# Altium schematic sheet Sensors.SchDoc
size A; SheetNumber: 3; SheetTotal: 4
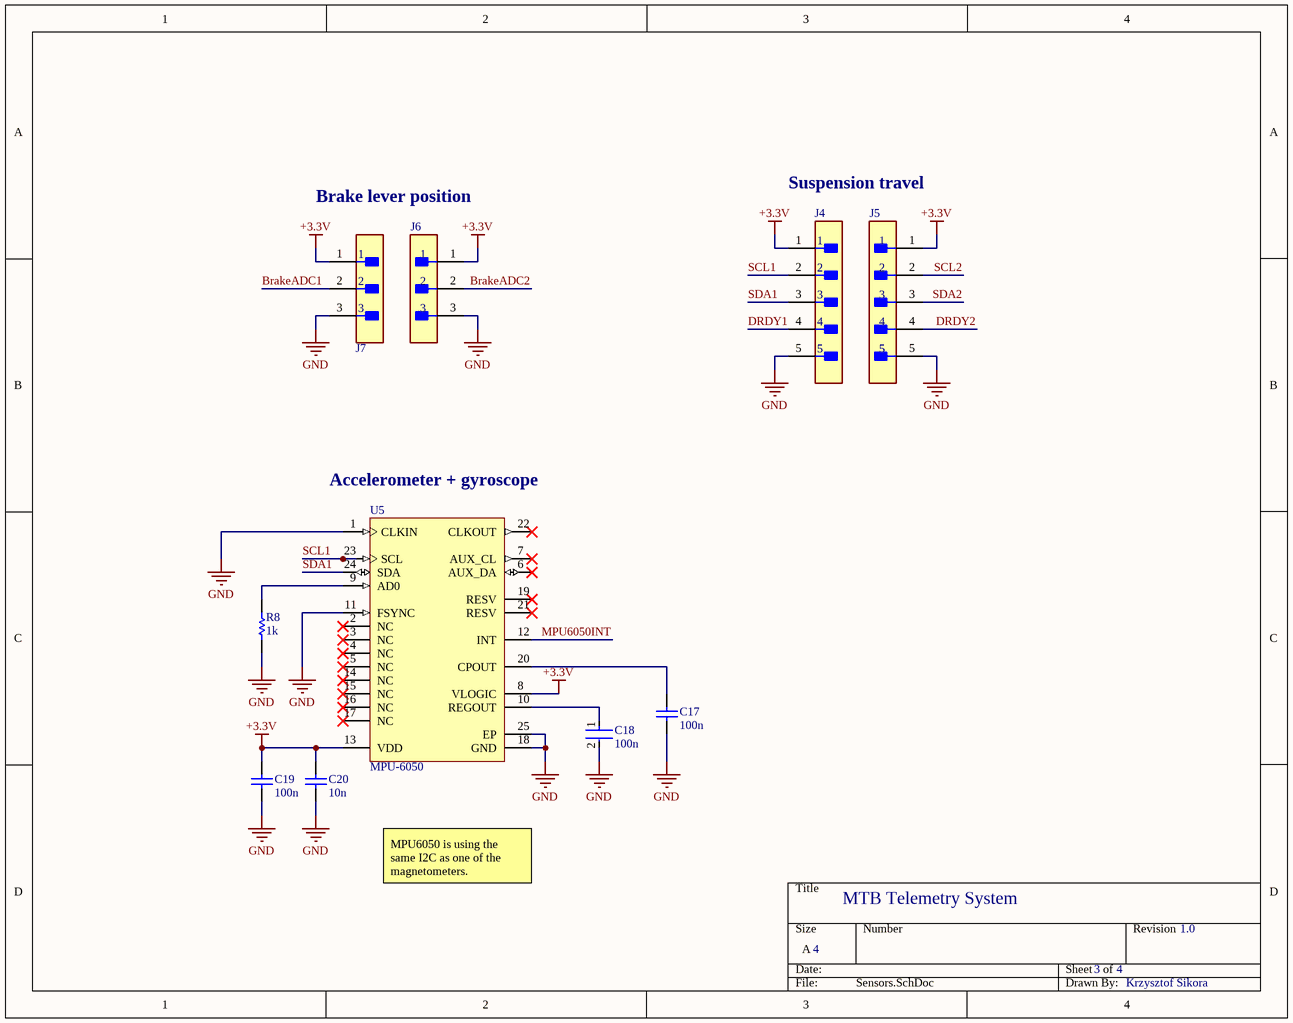
[diagram p0: Sensors.SchDoc]

## Parts
C17  100n  [CAPC2013X88X50LL20T25]
C18  100n  [FP-C0603C-CF-MFG]
C19  100n  [CAPC2013X88X50LL20T25]
C20  10n  [CAPC2013X88X50LL20T25]
J4  B5B-XH-AM(LF)(SN)  [FP-B5B-XH-AM_LF_SN-MFG]  (value not drawn)
J5  B5B-XH-AM(LF)(SN)  [FP-B5B-XH-AM_LF_SN-MFG]  (value not drawn)
J6  B3B-XH-A(LF)(SN)  [FP-B3B-XH-A_LF_SN-MFG]  (value not drawn)
J7  B3B-XH-A(LF)(SN)  [FP-B3B-XH-A_LF_SN-MFG]  (value not drawn)
R8  1k  [RESC2013X60X35ML10T20]
U5  MPU-6050  [IS-QFN-24_V]

## Nets
+3.3V: C19.2 C20.2 J4.1 J5.1 J6.1 J7.1 U5.8(VLOGIC) U5.13(VDD)
GND: C17.1 C18.2 C19.1 C20.1 J4.5 J5.5 J6.3 J7.3 R8.1 U5.1(CLKIN) U5.11(FSYNC) U5.18(GND) U5.25(EP)
BrakeADC1: J7.2
BrakeADC2: J6.2
DRDY1: J4.4
DRDY2: J5.4
MPU6050INT: U5.12(INT)
SCL1: J4.2 U5.23(SCL)
SCL2: J5.2
SDA1: J4.3 U5.24(SDA)
SDA2: J5.3
NetC17_2: C17.2 U5.20(CPOUT)
NetC18_1: C18.1 U5.10(REGOUT)
NetR8_2: R8.2 U5.9(AD0)

Not connected (* = marked no-connect by the designer): U5 2(NC)* 3(NC)* 4(NC)* 5(NC)* 6(AUX_DA)* 7(AUX_CL)* 14(NC)* 15(NC)* 16(NC)* 17(NC)* 19(RESV)* 21(RESV)* 22(CLKOUT)*

## Notes on the sheet
- Brake lever position
- Suspension travel
- (near U5) Accelerometer + gyroscope
- MPU6050 is using the same I2C as one of the magnetometers.
- MTB Telemetry System
- 4
- 3
- 1.0
- Krzysztof Sikora

## Library data of the parts
C17 C19 C20 = CMP-2007-00266-1: Manufacturer: Kemet; Part Number: C0805C103K5RACTU
C18 = CMP-2006-03061-2: CAP CER 0.1UF 50V X7R 0603; Manufacturer: KEMET; Manufacturer Part Number: C0603C104K5RACTU; Tolerance: 0.1; Temperature Coefficient: 30ppm/°C; Material: Ceramic; Automotive Grade: Grade 1; Value: 0.10 μF; Temperature: -55°C to +125°C; RoHS: TRUE; Temperature Range High: +125°C; Lead Free: Yes; Octopart: https://octopart.com/c0603c104k5ractu-kemet-139244; Digikey Description: CAP CER 0.1UF 50V X7R 0603; Category: Cap; Package: C0603C-CF; ComponentLink2Description: Datasheet; Temperature Range Low: -55°C; Device Class L1: Passive Components; Voltage Rating: 50 V; Automotive: Yes; Device Class L3: Ceramic Capacitors; ComponentLink2URL: https://api.kemet.com/component-edge/download/datasheet/C0603C100J5GACAUTO.pdf; Capacitance: 0.10 μF; Device Class L2: Capacitors; Temperature Characteristic: X7R; Height: 0.87mm
J4 J5 = CMP-17439-000304-1: CONN HEADER VERT 5POS 2.5MM; Mated Stacking Heights: 9.8mm; Voltage Rating: 250V; Max Current Rating: 3A; Number of Positions: 5; Contact Resistance: 20mR; Depth: 5.75mm; Connector Type: Header; Color: Green; Insulation Material: Nylon; Contact Plating: Copper; Length: 14.9mm; Fastening Type: Detent; Contact Material: Brass; Number of Rows: 1; Contact Type: Male Pin; Housing Material: Polyamide; Housing Color: White; Lead Free: Lead Free; Max Voltage Rating (AC): 250V; Mount: Through Hole; Contact Shape: Square; Min Operating Temperature: -25°C; Packaging: Bulk; Orientation: Straight; Insulation Color: Natural; Series: XH; Flammability Rating: UL94 V-0; Contact Finish - Mating: TIN; Max Operating Temperature: 85°C; Termination: Solder; Pitch: 2.5mm
J6 J7 = CMP-17439-000014-3: CONN HEADER VERT 3POS 2.5MM; Max Voltage Rating (DC): 250V; Number of Positions: 3; Current Rating: 3A; Gender: Male; Wire/Cable Gauge: 22AWG; Contact Resistance: 20mR; Insulation Resistance: 1GR; Insulation Material: Nylon; Contact Plating: Tin; Depth: 5.75mm; Contact Type: Male Pin; Max Operating Temperature: 85°C; Insulation Color: Natural; Voltage Rating (AC): 250V; Color: Natural; Connector Type: Header; Orientation: Straight; Fastening Type: Detent; Housing Color: White; Min Operating Temperature: -25°C; Termination: Solder; Voltage Rating: 250V; Series: XH; Pitch: 2.5mm; Contact Shape: Square; Number of Rows: 1; Lead Free: Lead Free; Packaging: Bulk; Mount: Through Hole; Flammability Rating: UL94 V-0; Max Voltage Rating (AC): 250V; REACH SVHC: No SVHC; Housing Material: Polyamide; Contact Material: Brass; Lead Pitch: 2.5mm; Contact Finish - Mating: TIN; Length: 9.9mm; Max Current Rating: 3A; Number of Contacts: 3
R8 = CMP-2100-03673-1: Chip Resistor, 0 Ohm, Jumper, +/- 5%, 0.125 W, -55 to 155 degC, 0805 (2012 Metric), RoHS, Tape and Reel; Manufacturer: Yageo; Power Rating: 125mW; Resistance: 0mOhm; Voltage Rating (DC): 150V; Temperature Coefficient: 200ppm/degreesC; Height: 0.5mm; Depth: 1.25mm; Case Code (Imperial): 0805; Lead Free: LeadFree; Military Standard: Not; Package Description: 2-Pin Surface Mounted Device, Body 2 x 1.25 mm; Case Code (Metric): 2012; Composition: ThickFilm; Voltage Rating: 150V; Manufacturer URL: http://www.yageo.com/; Packaging: TapeandReel; Package Reference: 0805; REACH SVHC: Unknown; Tolerance: 5%; Case/Package: 0805; Max Operating Temperature: 155degC; Number of Pins: 2; Min Operating Temperature: -55degC; RoHSCompliant: true; Length: 2mm; Datasheet URL: http://www.yageo.com/NewPortal/yageodocoutput?fileName=/pdf/R-Chip/PYu-RC_Group_51_RoHS_L_5.pdf; Termination: SMD/SMT; Radiation Hardening: No; Width: 1.25mm; Contact Plating: Tin; Datasheet Version: Rev. 5, 10/2016
U5 = CMP-1753-00002-2: 3-Axis Gyroscope, Accelerometer and a Digital Motion Processor(TM) (DMP), 2.375 to 3.46 V, -40 to 85 degC, 24-Pin QFN, RoHS, Tape and Reel; Manufacturer: InvenSense; Featured Product: MPU-60506-Axis,IntegratedI²CSolution; Other Names: 1428-1007-2 / MPU6050; Sensor Type: MotionTracking; Online Catalog: MPU-6000™Series; Unit PriceUSD: Digital; Datasheet Version: Rev. 3.3, 05/2012; Category: Sensors,Transducers; Datasheet URL: http://datasheet.octopart.com/MPU-6050-InvenSense-datasheet-14421344.pdf; Family: Multifunction; Standard Package: 5,000; Manufacturer URL: http://www.invensense.com/; Output Type: Digital; Dynamic Catalog: MPU-6000™Series